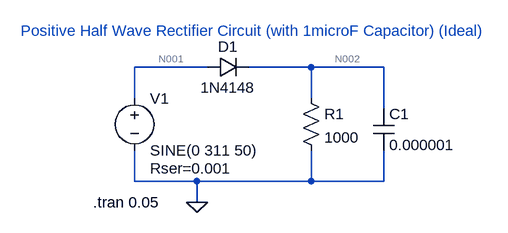
[diagram p0: schematic Assignment 3a (iii).asc]
Assignment 3a (iii).asc, the LTspice schematic file:
Version 4.1
SHEET 1 880 680
WIRE 192 64 80 64
WIRE 352 64 256 64
WIRE 464 64 352 64
WIRE 80 112 80 64
WIRE 352 112 352 64
WIRE 464 128 464 64
WIRE 80 240 80 192
WIRE 176 240 80 240
WIRE 352 240 352 192
WIRE 352 240 176 240
WIRE 464 240 464 192
WIRE 464 240 352 240
WIRE 176 272 176 240
FLAG 176 272 0
SYMBOL voltage 80 96 R0
WINDOW 123 0 0 Left 2
WINDOW 39 24 124 Left 2
SYMATTR SpiceLine Rser=0.001
SYMATTR InstName V1
SYMATTR Value SINE(0 311 50)
SYMBOL res 336 96 R0
SYMATTR InstName R1
SYMATTR Value 1000
SYMBOL diode 192 80 R270
WINDOW 0 32 32 VTop 2
WINDOW 3 0 32 VBottom 2
SYMATTR InstName D1
SYMATTR Value 1N4148
SYMBOL cap 448 128 R0
SYMATTR InstName C1
SYMATTR Value 0.000001
TEXT 16 272 Left 2 !.tran 0.05
TEXT 264 8 Center 2 ;Positive Half Wave Rectifier Circuit (with 1microF Capacitor) (Ideal)

The netlist it stands for:
* Assignment 3a (iii).asc
V1 N001 0 SINE(0 311 50) Rser=0.001
R1 N002 0 1000
D1 N001 N002 1N4148
C1 N002 0 0.000001
.model D D
.lib standard.dio
.tran 0.05
* Positive Half Wave Rectifier Circuit (with 1microF Capacitor) (Ideal)
.backanno
.end

* Results of the author's LTspice run, read from the files saved beside the schematic
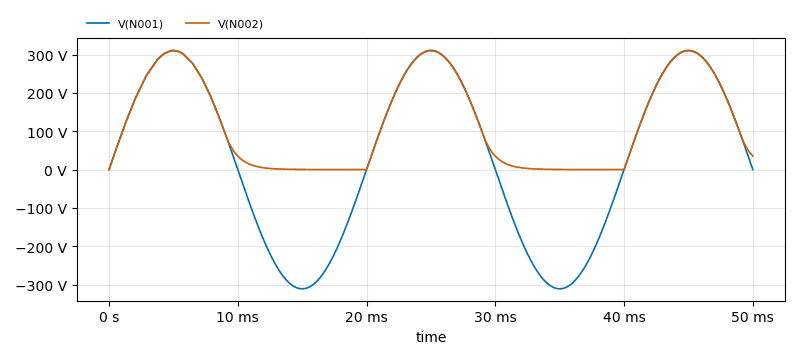
[diagram p1: Transient Analysis of Assignment 3a (iii).asc, plotted from the saved traces]
* Transient Analysis, 1 run:
*   V(N001): min -311 V, max 311 V, average 39.46 V, rms 219.9 V, last 0 V
*   V(N002): min 0 V, max 310 V, average 120.3 V, rms 169.9 V, last 35.15 V